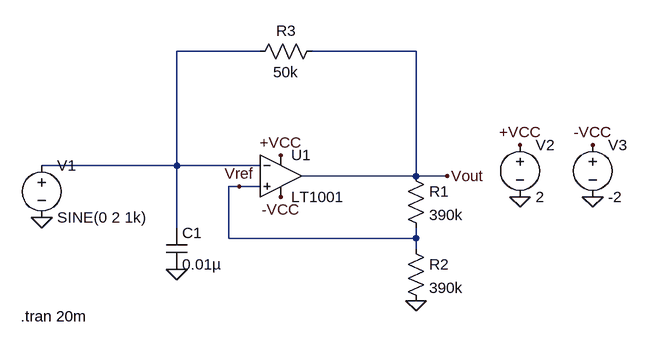
[diagram p0: schematic opampmultivibrator.asc]
opampmultivibrator.asc, the LTspice schematic file:
Version 4
SHEET 1 880 680
WIRE 80 -48 -48 -48
WIRE 320 -48 160 -48
WIRE -48 128 -48 -48
WIRE -48 128 -256 128
WIRE 80 128 -48 128
WIRE 320 144 320 -48
WIRE 320 144 144 144
WIRE 368 144 320 144
WIRE 48 160 32 160
WIRE 80 160 48 160
WIRE -48 224 -48 128
WIRE 32 240 32 160
WIRE 320 240 320 224
WIRE 320 240 32 240
WIRE 320 256 320 240
FLAG -48 288 0
FLAG 320 336 0
FLAG 480 176 0
FLAG 592 176 0
FLAG -256 208 0
FLAG 368 144 Vout
FLAG 480 96 +VCC
FLAG 112 112 +VCC
FLAG 592 96 -VCC
FLAG 112 176 -VCC
FLAG 48 160 Vref
SYMBOL OpAmps\\LT1001 112 80 R0
SYMATTR InstName U1
SYMBOL res 304 128 R0
SYMATTR InstName R1
SYMATTR Value 390k
SYMBOL res 304 240 R0
SYMATTR InstName R2
SYMATTR Value 390k
SYMBOL res 176 -64 R90
WINDOW 0 0 56 VBottom 2
WINDOW 3 32 56 VTop 2
SYMATTR InstName R3
SYMATTR Value 50k
SYMBOL voltage -256 112 R0
WINDOW 123 0 0 Left 0
WINDOW 39 0 0 Left 0
SYMATTR InstName V1
SYMATTR Value SINE(0 2 1k)
SYMBOL voltage 480 80 R0
SYMATTR InstName V2
SYMATTR Value 2
SYMBOL voltage 592 80 R0
SYMATTR InstName V3
SYMATTR Value -2
SYMBOL cap -64 224 R0
SYMATTR InstName C1
SYMATTR Value 0.01µ
TEXT -288 360 Left 2 !.tran 20m

The netlist it stands for:
* opampmultivibrator.asc
XU1 Vref N001 +VCC -VCC Vout LT1001  ; pins In+ In- V+ V- OUT
R1 Vout Vref 390k
R2 Vref 0 390k
R3 Vout N001 50k
V1 N001 0 SINE(0 2 1k)
V2 +VCC 0 2
V3 -VCC 0 -2
C1 N001 0 0.01µ
.tran 20m
.lib LTC.lib
.backanno
.end

* Results of the author's LTspice run, read from the files saved beside the schematic
* Operating Point, zero values left out:
*   V(+vcc) = 2 V
*   V(-vcc) = -2 V
*   I(V3) = 2.25 mA
*   I(V2) = -2.25 mA
*   Ix(u1:3) = 2.25 mA
*   Ix(u1:4) = -2.25 mA
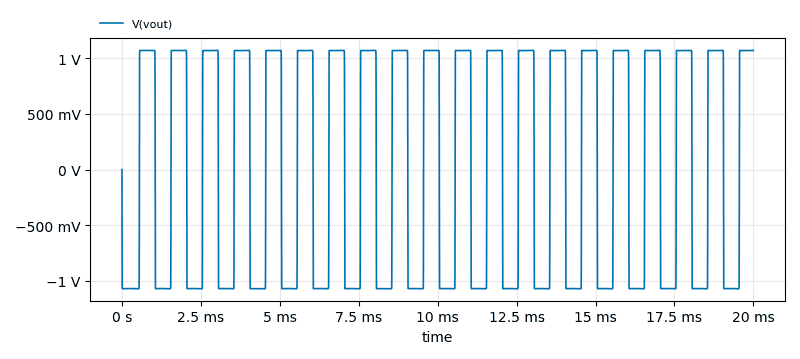
[diagram p1: Transient Analysis of opampmultivibrator.asc, plotted from the saved traces]
* Transient Analysis, 1 run:
*   V(vout): min -1.07 V, max 1.07 V, average -5.491 mV, rms 1.061 V, last 1.07 V